# Altium schematic sheet STM32 for Cal V1.0.SchDoc
size A4
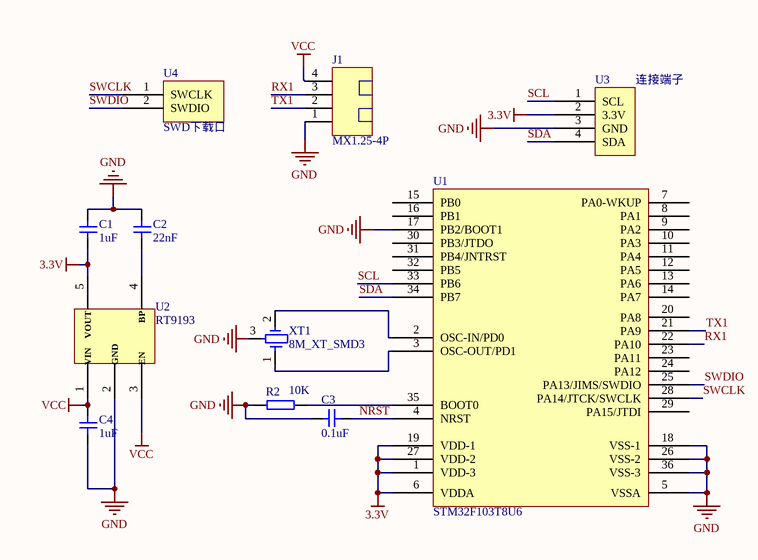
[diagram p0: STM32 for Cal V1.0.SchDoc]

## Parts
C1  1uF  [0603C]
C2  22nF  [0603C]
C3  0.1uF  [0603C]
C4  1uF  [0603C]
J1  MX1.25-4P  [MX1.25-4P]
R2  10K  [0603R]
U1  STM32F103T8U6  [QFN-36B6R00x6R00]
U2  RT9193  [RT9193]
U3  连接端子  [连接端子]
U4  SWD下载口  [SWD下载口]
XT1  8M_XT_SMD3  [三脚贴片8M晶振1.5*3.5]

## Nets
3.3V: C1.1 U1.1(VDD-3) U1.6(VDDA) U1.19(VDD-1) U1.27(VDD-2) U2.5(VOUT) U3.2(3.3V)
GND: C1.2 C2.2 C3.2 C4.1 J1.1 R2.1 U1.5(VSSA) U1.17(PB2/BOOT1) U1.18(VSS-1) U1.26(VSS-2) U1.36(VSS-3) U2.2(GND) U3.3(GND) XT1.3
VCC: C4.2 J1.4 U2.1(VIN) U2.3(EN)
NRST: C3.1 U1.4(NRST)
RX1: J1.3 U1.22(PA10)
SCL: U1.33(PB6) U3.1(SCL)
SDA: U1.34(PB7) U3.4(SDA)
SWCLK: U1.28(PA14/JTCK/SWCLK) U4.1(SWCLK)
SWDIO: U1.25(PA13/JIMS/SWDIO) U4.2(SWDIO)
TX1: J1.2 U1.21(PA9)
NetC2_1: C2.1 U2.4(BP)
NetR2_2: R2.2 U1.35(BOOT0)
NetU1_2: U1.2(OSC-IN/PD0) XT1.2
NetU1_3: U1.3(OSC-OUT/PD1) XT1.1

Not connected (* = marked no-connect by the designer): U1 7(PA0-WKUP) 8(PA1) 9(PA2) 10(PA3) 11(PA4) 12(PA5) 13(PA6) 14(PA7) 15(PB0) 16(PB1) 20(PA8) 23(PA11) 24(PA12) 29(PA15/JTDI) 30(PB3/JTDO) 31(PB4/JNTRST) 32(PB5)

## Library data of the parts
C1-C4 = Cap1: 无极贴片电容
J1 = MX1.25-4P_1
R2 = Res: 电阻
XT1 = 8M_XT-SMD3